# Altium schematic sheet RES_IN24.SchDoc
size 127 x 127 mm
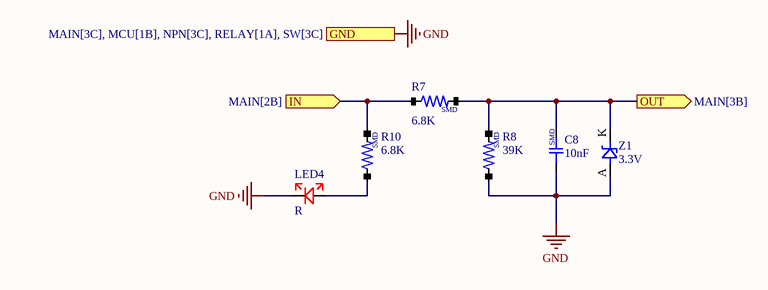
[diagram p0: RES_IN24.SchDoc]

## Parts
C8  10nF  [CAP-0603]
LED4  R  [LED/0805]
R7  6.8K  [RES/0805]
R8  39K  [RES/0805]
R10  6.8K  [RES/0805]
Z1  3.3V  [mini_melf]

## Ports
GND (see MAIN[3C], MCU[1B], NPN[3C], RELAY[1A], SW[3C]), IN (in, see MAIN[2B]), OUT (out, see MAIN[3B])

## Nets
GND: C8.1 LED4.K R8.1 Z1.A ; port GND
IN: R7.1 R10.2 ; port IN
OUT: C8.2 R7.2 R8.2 Z1.K ; port OUT
NetLED4_A: LED4.A R10.1

## Notes on the sheet
- (in symbol cap_smd) SMD
- (in symbol RES/SMD) SMD

## Library data of the parts
C8 = cap_smd
LED4 = LED-1COLER
R7 R8 R10 = RES/SMD
Z1 = zener-0.5w